# Altium schematic sheet Server QSPI Flash & EEPROM.schdoc
size 383 x 241 mm
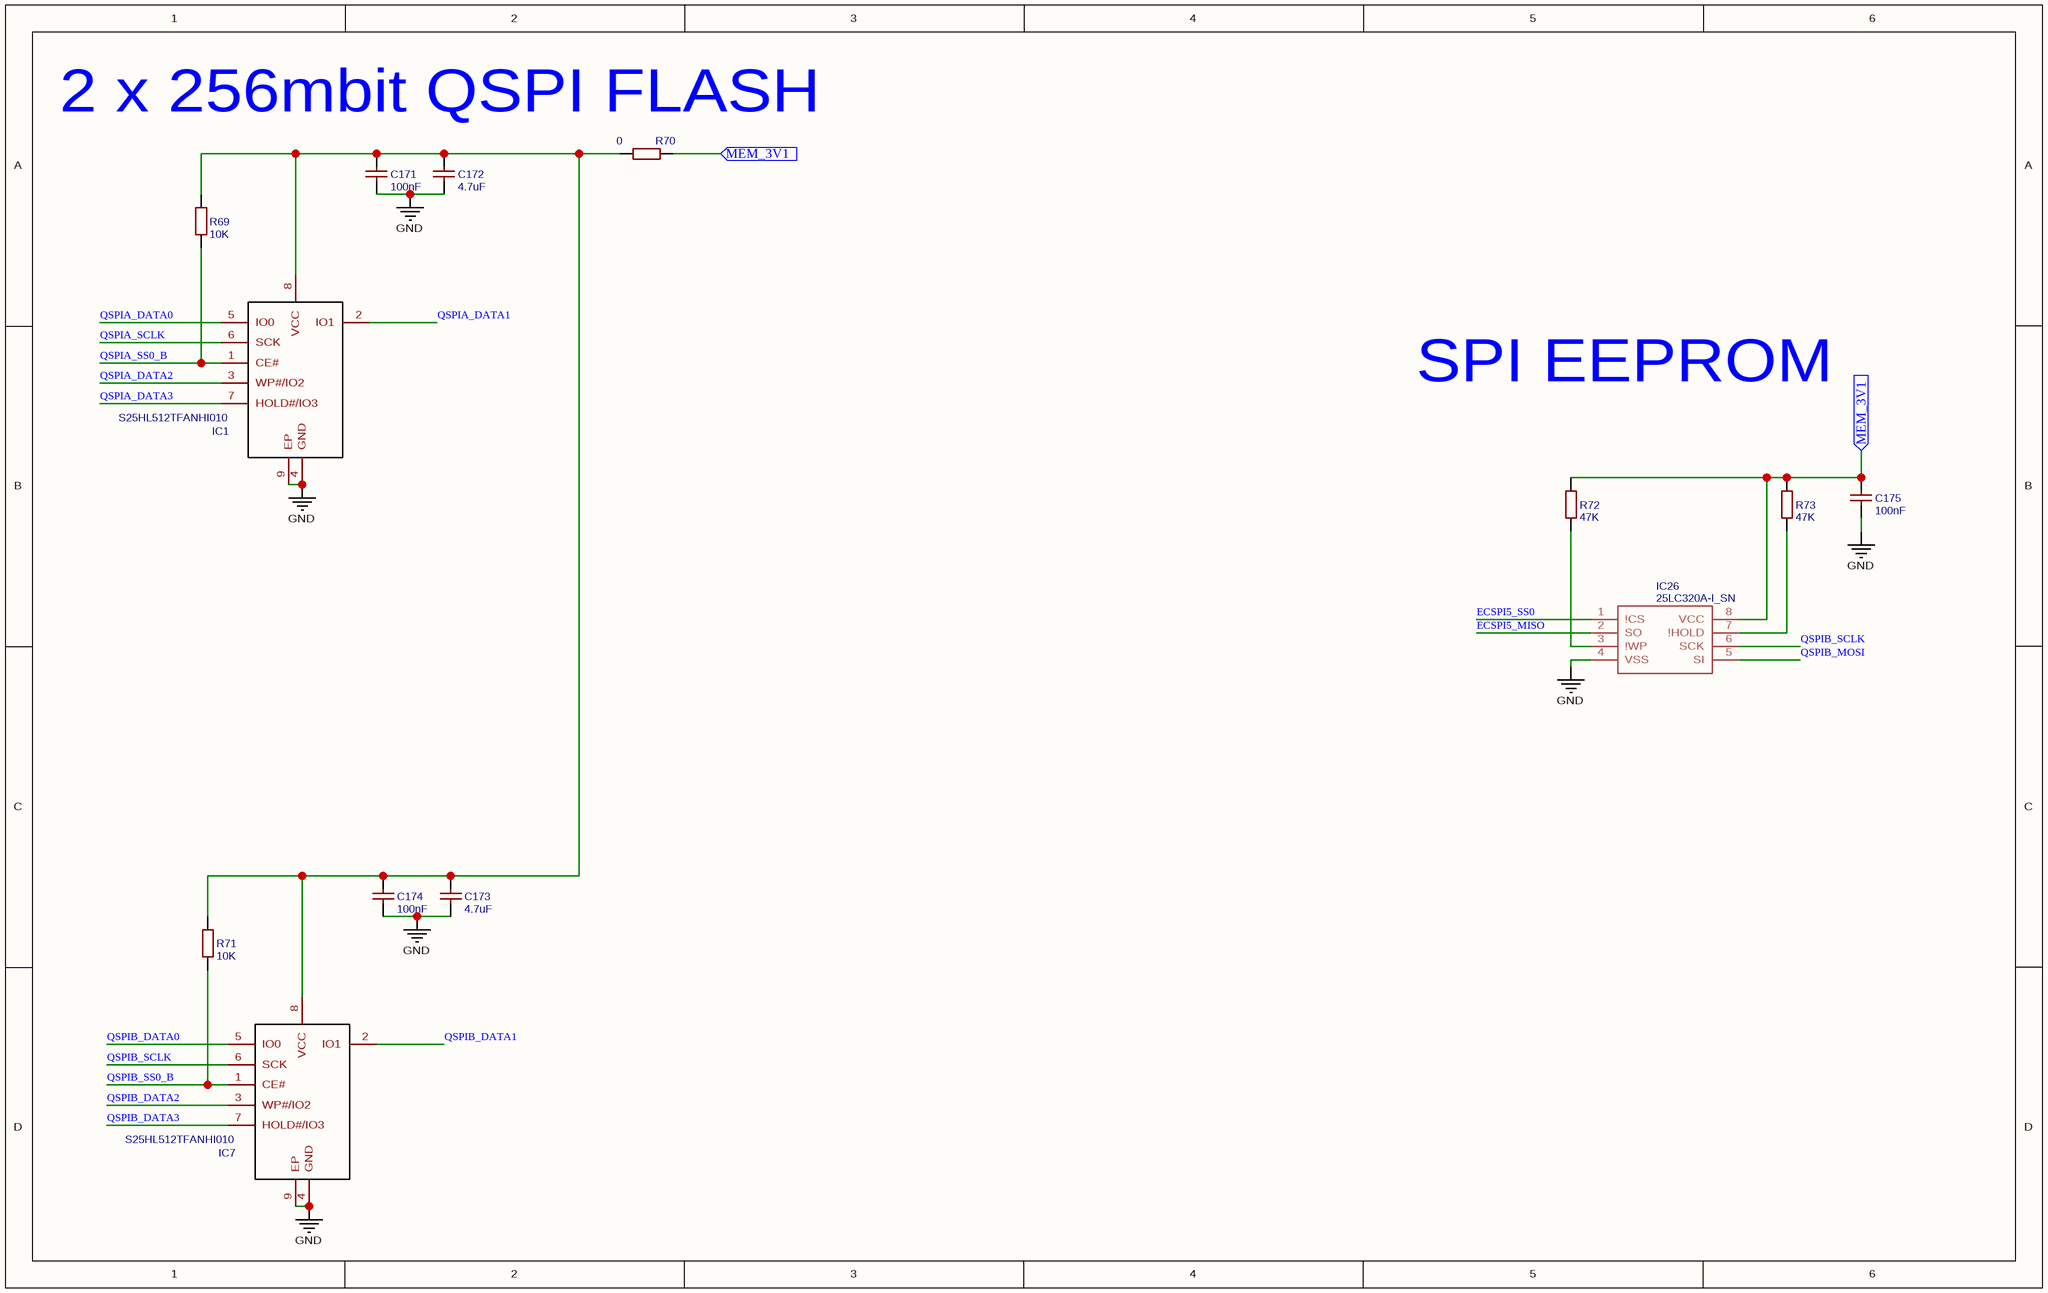
[diagram p0: Server QSPI Flash & EEPROM.schdoc]

## Parts
C171  100nF  [C0805]
C172  4.7uF  [C0402]
C173  4.7uF  [C0402]
C174  100nF  [C0805]
C175  100nF  [C0805]
IC1  S25HL512TFANHI010  [SON127P800X600X80-9N]
IC7  S25HL512TFANHI010  [SON127P800X600X80-9N]
IC26  25LC320A-I_SN  [SOIC127P600X175-8N]
R69  10K  [R0402]
R70  0  [R0402]
R71  10K  [R0402]
R72  47K  [R0805]
R73  47K  [R0805]

## Ports
MEM_3V1 (in)

## Nets
GND: C171.1 C172.1 C173.1 C174.1 C175.1 IC1.4(GND) IC1.9(EP) IC7.4(GND) IC7.9(EP) IC26.4(VSS)
ECSPI5_MISO: IC26.2(SO)
ECSPI5_SS0: IC26.1(!CS)
MEM_3V1: C175.2 IC26.8(VCC) R70.2 R72.2 R73.2 ; port MEM_3V1
QSPIA_DATA0: IC1.5(IO0)
QSPIA_DATA1: IC1.2(IO1)
QSPIA_DATA2: IC1.3(WP#/IO2)
QSPIA_DATA3: IC1.7(HOLD#/IO3)
QSPIA_SCLK: IC1.6(SCK)
QSPIA_SS0_B: IC1.1(CE#) R69.1
QSPIB_DATA0: IC7.5(IO0)
QSPIB_DATA1: IC7.2(IO1)
QSPIB_DATA2: IC7.3(WP#/IO2)
QSPIB_DATA3: IC7.7(HOLD#/IO3)
QSPIB_MOSI: IC26.5(SI)
QSPIB_SCLK: IC7.6(SCK) IC26.6(SCK)
QSPIB_SS0_B: IC7.1(CE#) R71.1
NetC171_2: C171.2 C172.2 C173.2 C174.2 IC1.8(VCC) IC7.8(VCC) R69.2 R70.1 R71.2
NetIC26_3: IC26.3(!WP) R72.1
NetIC26_7: IC26.7(!HOLD) R73.1

## Notes on the sheet
- 2 x 256mbit QSPI FLASH
- SPI EEPROM

## Library data of the parts
C171 C174 C175 = 100nF: BOM_Manufacturer Part: CC0805KRX7R9BB104; BOM_Manufacturer: YAGEO; nameAlias: Capacitance; SMT Type: Basic; BOM_Supplier: LCSC; BOM_LCSC Assembly: Yes; BOM_Supplier Part: C49678; spicePre: C; spiceSymbolName: CC0805KRX7R9BB104
C172 C173 = 4.7uF: BOM_Manufacturer Part: CL05A475MP5NRNC; BOM_Manufacturer: SAMSUNG; nameAlias: Capacitance; SMT Type: Basic; BOM_Supplier: LCSC; BOM_LCSC Assembly: Yes; BOM_Supplier Part: C23733; spicePre: C; spiceSymbolName: CL05A475MP5NRNC
IC1 IC7 = S25HL512TFANHI010: Contributor: Ke'Ondrae_Mell; spicePre: I; spiceSymbolName: S25HL512TFANHI010
IC26 = 25LC320A-I_SN: Contributor: Ke'Ondrae_Mell; spicePre: I; spiceSymbolName: 25LC320A-I_SN
R69 R71 = 10K: BOM_Manufacturer: UniOhm; BOM_Manufacturer Part: 0402WGF1002TCE; nameAlias: Resistance (Ohms); SMT Type: Basic; BOM_Supplier: LCSC; BOM_LCSC Assembly: Yes; BOM_Supplier Part: C25744; spicePre: R; spiceSymbolName: 0402WGF1002TCE
R70 = 0: BOM_Manufacturer: KOA; BOM_Manufacturer Part: RK73Z1ETTP; nameAlias: Resistance (Ohms); BOM_Supplier: LCSC; BOM_Supplier Part: C131359; spicePre: R; spiceSymbolName: RK73Z1ETTP
R72 R73 = 47K: BOM_Manufacturer: UniOhm; BOM_Manufacturer Part: 0805W8F4702T5E; nameAlias: Resistance (Ohms); SMT Type: Basic; BOM_Supplier: LCSC; BOM_LCSC Assembly: Yes; BOM_Supplier Part: C17713; spicePre: R; spiceSymbolName: 0805W8F4702T5E